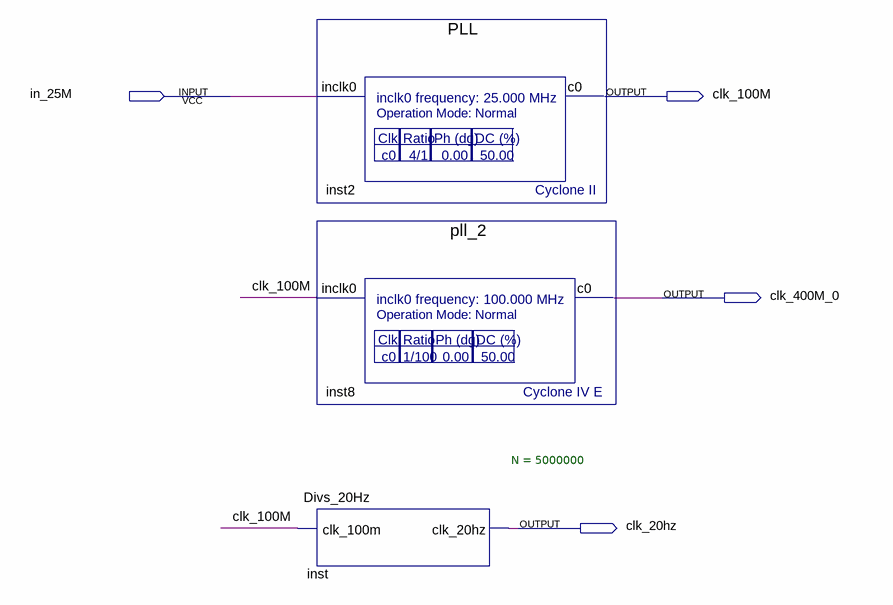
[diagram p0: schematic sheet]
// Quartus schematic CLOCK.bdf as structural Verilog: 3 symbols, 4 pins
module CLOCK (
  input  in_25M,
  output clk_100M,
  output clk_400M_0,
  output clk_20hz
);

  PLL inst2 (.inclk0(in_25M), .c0(clk_100M));
  pll_2 inst8 (.inclk0(clk_100M), .c0(clk_400M_0));
  Divs_20Hz #(.N(5000000)) inst (.clk_100m(clk_100M), .clk_20hz(clk_20hz));
endmodule
